# Altium schematic sheet FMC 400 Pin.SchDoc: Altium FMC Sheet
size A3; Date: 8/14/2017; ApprovedBy: NA; CompanyName: Cospan Design LLC; DrawnBy: Altium; Engineer: Altium; DocumentNumber: 16; SheetNumber: 16; SheetTotal: 20; Project: Enigma; SheetName: Altium FMC Sheet; ProjectPrettyName: Enigma; Client: Public
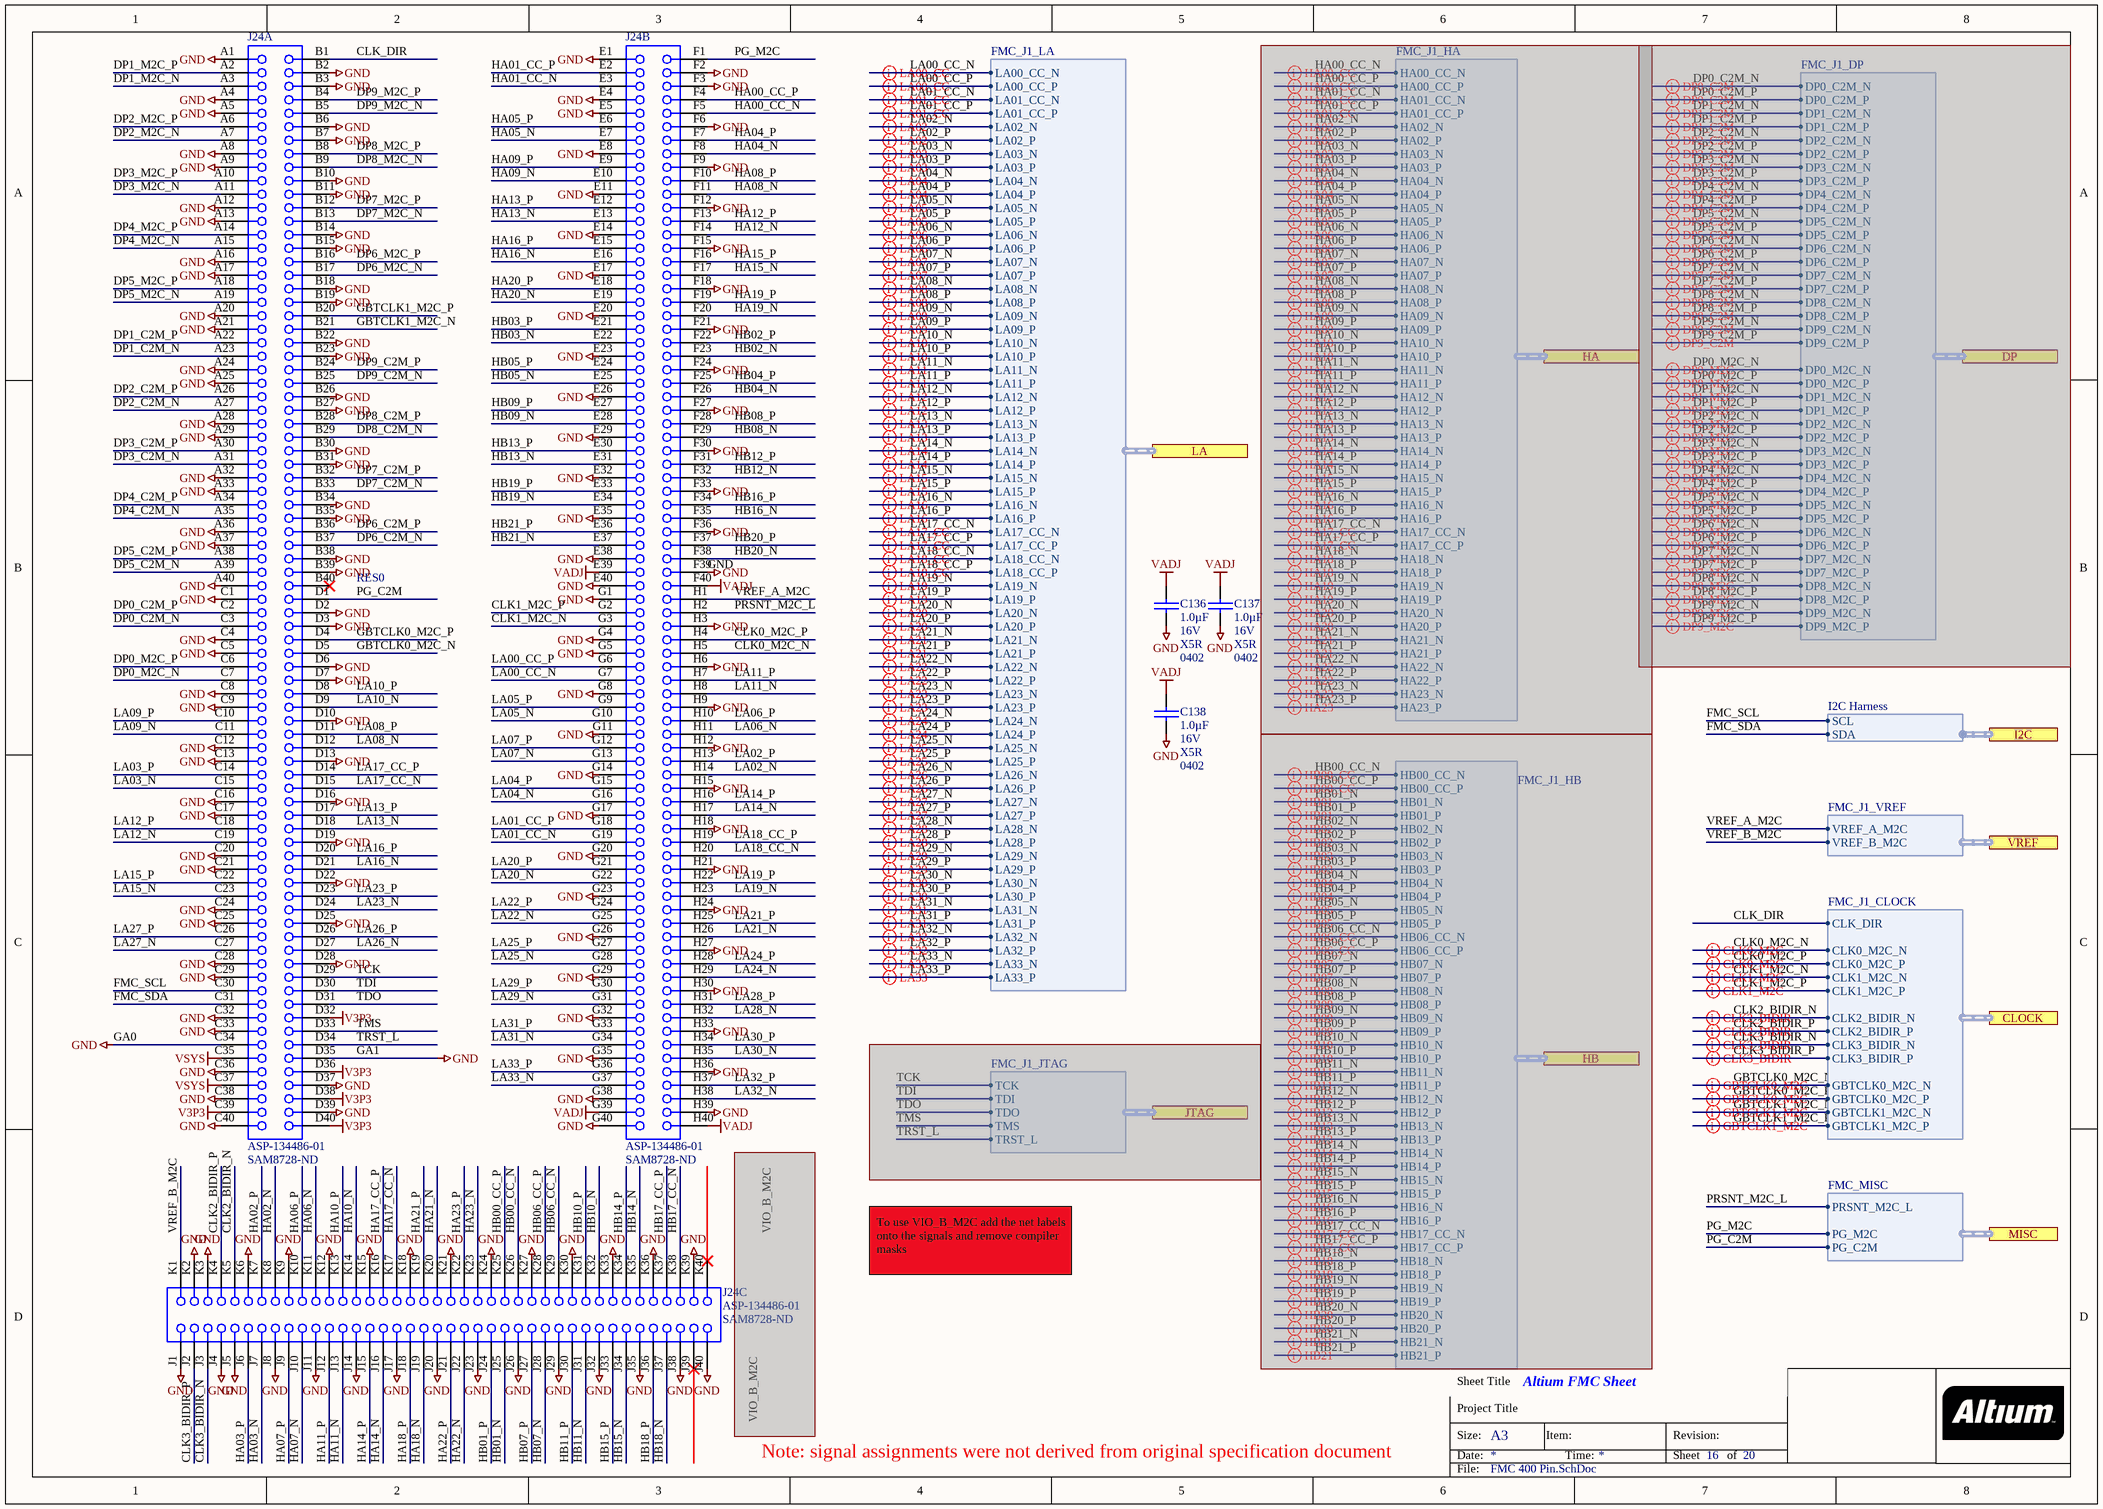
[diagram p0: FMC 400 Pin.SchDoc]

## Parts
C136  Capacitance: 1.0µF  Voltage - Rated: 16V  Temperature Coefficient: X5R  Package / Case: 0402  [C_ERA-0402]  (hidden comment: 1.0uF)
C137  Capacitance: 1.0µF  Voltage - Rated: 16V  Temperature Coefficient: X5R  Package / Case: 0402  [C_ERA-0402]  (hidden comment: 1.0uF)
C138  Capacitance: 1.0µF  Voltage - Rated: 16V  Temperature Coefficient: X5R  Package / Case: 0402  [C_ERA-0402]  (hidden comment: 1.0uF)
J24  ASP-134486-01  Supplier Part Number 1: SAM8728-ND  [BTB-SM1-27-2V400F]  (parts A,B,C of 3)

## Ports
CLOCK (harness FMC_J1_CLOCK), DP (harness FMC_J1_DP), HA (harness FMC_J1_HA), HB (harness FMC_J1_HB), I2C (harness I2C Harness), JTAG (harness FMC_J1_JTAG), LA (harness FMC_J1_LA), MISC (harness FMC_MISC), VREF (harness FMC_J1_VREF)

## Harnesses
FMC_J1_DP: DP1_C2M_N, DP1_C2M_P, DP1_M2C_N, DP1_M2C_P, DP2_C2M_N, DP2_C2M_P, DP2_M2C_N, DP2_M2C_P, DP3_C2M_N, DP3_C2M_P, DP3_M2C_N, DP3_M2C_P, DP4_C2M_N, DP4_C2M_P, DP4_M2C_N, DP4_M2C_P, DP5_C2M_N, DP5_C2M_P, DP5_M2C_N, DP5_M2C_P, DP6_C2M_N, DP6_C2M_P, DP6_M2C_N, DP6_M2C_P, DP7_C2M_N, DP7_C2M_P, DP7_M2C_N, DP7_M2C_P, DP8_C2M_N, DP8_C2M_P, DP8_M2C_N, DP8_M2C_P, DP9_C2M_N, DP9_C2M_P, DP9_M2C_N, DP9_M2C_P, DP0_C2M_N, DP0_C2M_P, DP0_M2C_N, DP0_M2C_P
FMC_J1_LA: LA05_N, LA05_P, LA06_N, LA06_P, LA09_N, LA09_P, LA10_N, LA10_P, LA13_N, LA13_P, LA14_N, LA14_P, LA23_N, LA23_P, LA26_N, LA26_P, LA27_N, LA27_P, LA02_N, LA02_P, LA03_N, LA03_P, LA04_N, LA04_P, LA07_N, LA07_P, LA08_N, LA08_P, LA11_N, LA11_P, LA12_N, LA12_P, LA15_N, LA15_P, LA16_N, LA16_P, LA19_N, LA19_P, LA20_N, LA20_P, LA21_N, LA21_P, LA22_N, LA22_P, LA24_N, LA24_P, LA25_N, LA25_P, LA28_N, LA28_P, LA29_N, LA29_P, LA30_N, LA30_P, LA31_N, LA31_P, LA32_N, LA32_P, LA33_N, LA33_P, LA00_CC_N, LA00_CC_P, LA01_CC_N, LA01_CC_P, LA17_CC_N, LA17_CC_P, LA18_CC_N, LA18_CC_P
FMC_J1_HA: HA04_N, HA04_P, HA05_N, HA05_P, HA08_N, HA08_P, HA09_N, HA09_P, HA12_N, HA12_P, HA13_N, HA13_P, HA15_N, HA15_P, HA16_N, HA16_P, HA19_N, HA19_P, HA20_N, HA20_P, HA02_N, HA02_P, HA03_N, HA03_P, HA06_N, HA06_P, HA07_N, HA07_P, HA10_N, HA10_P, HA11_N, HA11_P, HA14_N, HA14_P, HA18_N, HA18_P, HA21_N, HA21_P, HA22_N, HA22_P, HA23_N, HA23_P, HA17_CC_N, HA17_CC_P, HA00_CC_N, HA00_CC_P, HA01_CC_N, HA01_CC_P
FMC_J1_HB: HB02_N, HB02_P, HB03_N, HB03_P, HB04_N, HB04_P, HB05_N, HB05_P, HB08_N, HB08_P, HB09_N, HB09_P, HB12_N, HB12_P, HB13_N, HB13_P, HB16_N, HB16_P, HB19_N, HB19_P, HB20_N, HB20_P, HB21_N, HB21_P, HB01_N, HB01_P, HB07_N, HB07_P, HB10_N, HB10_P, HB11_N, HB11_P, HB14_N, HB14_P, HB15_N, HB15_P, HB18_N, HB18_P, HB17_CC_N, HB17_CC_P, HB06_CC_N, HB06_CC_P, HB00_CC_N, HB00_CC_P
FMC_MISC: PRSNT_M2C_L, PG_M2C, PG_C2M
FMC_J1_JTAG: TCK, TDI, TDO, TMS, TRST_L
FMC_J1_CLOCK: CLK2_BIDIR_N, CLK2_BIDIR_P, CLK3_BIDIR_N, CLK3_BIDIR_P, CLK0_M2C_N, CLK0_M2C_P, CLK1_M2C_N, CLK1_M2C_P, CLK_DIR, GBTCLK0_M2C_N, GBTCLK0_M2C_P, GBTCLK1_M2C_N, GBTCLK1_M2C_P
FMC_J1_VREF: VREF_A_M2C, VREF_B_M2C
I2C Harness: SCL, SDA

## Nets
GA0: C136.1 C137.1 C138.1 J24.A1 J24.A4 J24.A5 J24.A8 J24.A9 J24.A12 J24.A13 J24.A16 J24.A17 J24.A20 J24.A21 J24.A24 J24.A25 J24.A28 J24.A29 J24.A32 J24.A33 J24.A36 J24.A37 J24.A40 J24.B2 J24.B3 J24.B6 J24.B7 J24.B10 J24.B11 J24.B14 J24.B15 J24.B18 J24.B19 J24.B22 J24.B23 J24.B26 J24.B27 J24.B30 J24.B31 J24.B34 J24.B35 J24.B38 J24.B39 J24.C1 J24.C4 J24.C5 J24.C8 J24.C9 J24.C12 J24.C13 J24.C16 J24.C17 J24.C20 J24.C21 J24.C24 J24.C25 J24.C28 J24.C29 J24.C32 J24.C33 J24.C34 J24.C36 J24.C38 J24.C40 J24.D2 J24.D3 J24.D6 J24.D7 J24.D10 J24.D13 J24.D16 J24.D19 J24.D22 J24.D25 J24.D28 J24.D35 J24.D37 J24.D39 J24.E1 J24.E4 J24.E5 J24.E8 J24.E11 J24.E14 J24.E17 J24.E20 J24.E23 J24.E26 J24.E29 J24.E32 J24.E35 J24.E38 J24.E40 J24.F2 J24.F3 J24.F6 J24.F9 J24.F12 J24.F15 J24.F18 J24.F21 J24.F24 J24.F27 J24.F30 J24.F33 J24.F36 J24.F39 J24.G1 J24.G4 J24.G5 J24.G8 J24.G11 J24.G14 J24.G17 J24.G20 J24.G23 J24.G26 J24.G29 J24.G32 J24.G35 J24.G38 J24.G40 J24.H3 J24.H6 J24.H9 J24.H12 J24.H15 J24.H18 J24.H21 J24.H24 J24.H27 J24.H30 J24.H33 J24.H36 J24.H39 J24.J1 J24.J4 J24.J5 J24.J8 J24.J11 J24.J14 J24.J17 J24.J20 J24.J23 J24.J26 J24.J29 J24.J32 J24.J35 J24.J38 J24.J40 J24.K2 J24.K3 J24.K6 J24.K9 J24.K12 J24.K15 J24.K18 J24.K21 J24.K24 J24.K27 J24.K30 J24.K33 J24.K36 J24.K39  [also labelled GA1, GND]
V3P3: J24.C39 J24.D32 J24.D36 J24.D38 J24.D40
VADJ: C136.2 C137.2 C138.2 J24.E39 J24.F40 J24.G39 J24.H40
VSYS: J24.C35 J24.C37
CLK0_M2C_N: J24.H5 ; port CLOCK.CLK0_M2C_N
CLK0_M2C_P: J24.H4 ; port CLOCK.CLK0_M2C_P
CLK1_M2C_N: J24.G3 ; port CLOCK.CLK1_M2C_N
CLK1_M2C_P: J24.G2 ; port CLOCK.CLK1_M2C_P
CLK2_BIDIR_N: J24.K5 ; port CLOCK.CLK2_BIDIR_N
CLK2_BIDIR_P: J24.K4 ; port CLOCK.CLK2_BIDIR_P
CLK3_BIDIR_N: J24.J3 ; port CLOCK.CLK3_BIDIR_N
CLK3_BIDIR_P: J24.J2 ; port CLOCK.CLK3_BIDIR_P
CLK_DIR: J24.B1 ; port CLOCK.CLK_DIR
DP0_C2M_N: J24.C3
DP0_C2M_P: J24.C2
DP0_M2C_N: J24.C7
DP0_M2C_P: J24.C6
DP1_C2M_N: J24.A23
DP1_C2M_P: J24.A22
DP1_M2C_N: J24.A3
DP1_M2C_P: J24.A2
DP2_C2M_N: J24.A27
DP2_C2M_P: J24.A26
DP2_M2C_N: J24.A7
DP2_M2C_P: J24.A6
DP3_C2M_N: J24.A31
DP3_C2M_P: J24.A30
DP3_M2C_N: J24.A11
DP3_M2C_P: J24.A10
DP4_C2M_N: J24.A35
DP4_C2M_P: J24.A34
DP4_M2C_N: J24.A15
DP4_M2C_P: J24.A14
DP5_C2M_N: J24.A39
DP5_C2M_P: J24.A38
DP5_M2C_N: J24.A19
DP5_M2C_P: J24.A18
DP6_C2M_N: J24.B37
DP6_C2M_P: J24.B36
DP6_M2C_N: J24.B17
DP6_M2C_P: J24.B16
DP7_C2M_N: J24.B33
DP7_C2M_P: J24.B32
DP7_M2C_N: J24.B13
DP7_M2C_P: J24.B12
DP8_C2M_N: J24.B29
DP8_C2M_P: J24.B28
DP8_M2C_N: J24.B9
DP8_M2C_P: J24.B8
DP9_C2M_N: J24.B25
DP9_C2M_P: J24.B24
DP9_M2C_N: J24.B5
DP9_M2C_P: J24.B4
FMC_SCL: J24.C30 ; port I2C.SCL
FMC_SDA: J24.C31 ; port I2C.SDA
GBTCLK0_M2C_N: J24.D5 ; port CLOCK.GBTCLK0_M2C_N
GBTCLK0_M2C_P: J24.D4 ; port CLOCK.GBTCLK0_M2C_P
GBTCLK1_M2C_N: J24.B21 ; port CLOCK.GBTCLK1_M2C_N
GBTCLK1_M2C_P: J24.B20 ; port CLOCK.GBTCLK1_M2C_P
HA00_CC_N: J24.F5
HA00_CC_P: J24.F4
HA01_CC_N: J24.E3
HA01_CC_P: J24.E2
HA02_N: J24.K8
HA02_P: J24.K7
HA03_N: J24.J7
HA03_P: J24.J6
HA04_N: J24.F8
HA04_P: J24.F7
HA05_N: J24.E7
HA05_P: J24.E6
HA06_N: J24.K11
HA06_P: J24.K10
HA07_N: J24.J10
HA07_P: J24.J9
HA08_N: J24.F11
HA08_P: J24.F10
HA09_N: J24.E10
HA09_P: J24.E9
HA10_N: J24.K14
HA10_P: J24.K13
HA11_N: J24.J13
HA11_P: J24.J12
HA12_N: J24.F14
HA12_P: J24.F13
HA13_N: J24.E13
HA13_P: J24.E12
HA14_N: J24.J16
HA14_P: J24.J15
HA15_N: J24.F17
HA15_P: J24.F16
HA16_N: J24.E16
HA16_P: J24.E15
HA17_CC_N: J24.K17
HA17_CC_P: J24.K16
HA18_N: J24.J19
HA18_P: J24.J18
HA19_N: J24.F20
HA19_P: J24.F19
HA20_N: J24.E19
HA20_P: J24.E18
HA21_N: J24.K20
HA21_P: J24.K19
HA22_N: J24.J22
HA22_P: J24.J21
HA23_N: J24.K23
HA23_P: J24.K22
HB00_CC_N: J24.K26
HB00_CC_P: J24.K25
HB01_N: J24.J25
HB01_P: J24.J24
HB02_N: J24.F23
HB02_P: J24.F22
HB03_N: J24.E22
HB03_P: J24.E21
HB04_N: J24.F26
HB04_P: J24.F25
HB05_N: J24.E25
HB05_P: J24.E24
HB06_CC_N: J24.K29
HB06_CC_P: J24.K28
HB07_N: J24.J28
HB07_P: J24.J27
HB08_N: J24.F29
HB08_P: J24.F28
HB09_N: J24.E28
HB09_P: J24.E27
HB10_N: J24.K32
HB10_P: J24.K31
HB11_N: J24.J31
HB11_P: J24.J30
HB12_N: J24.F32
HB12_P: J24.F31
HB13_N: J24.E31
HB13_P: J24.E30
HB14_N: J24.K35
HB14_P: J24.K34
HB15_N: J24.J34
HB15_P: J24.J33
HB16_N: J24.F35
HB16_P: J24.F34
HB17_CC_N: J24.K38
HB17_CC_P: J24.K37
HB18_N: J24.J37
HB18_P: J24.J36
HB19_N: J24.E34
HB19_P: J24.E33
HB20_N: J24.F38
HB20_P: J24.F37
HB21_N: J24.E37
HB21_P: J24.E36
LA00_CC_N: J24.G7 ; port LA.LA00_CC_N
LA00_CC_P: J24.G6 ; port LA.LA00_CC_P
LA01_CC_N: J24.G19 ; port LA.LA01_CC_N
LA01_CC_P: J24.G18 ; port LA.LA01_CC_P
LA02_N: J24.H14 ; port LA.LA02_N
LA02_P: J24.H13 ; port LA.LA02_P
LA03_N: J24.C15 ; port LA.LA03_N
LA03_P: J24.C14 ; port LA.LA03_P
LA04_N: J24.G16 ; port LA.LA04_N
LA04_P: J24.G15 ; port LA.LA04_P
LA05_N: J24.G10 ; port LA.LA05_N
LA05_P: J24.G9 ; port LA.LA05_P
LA06_N: J24.H11 ; port LA.LA06_N
LA06_P: J24.H10 ; port LA.LA06_P
LA07_N: J24.G13 ; port LA.LA07_N
LA07_P: J24.G12 ; port LA.LA07_P
LA08_N: J24.D12 ; port LA.LA08_N
LA08_P: J24.D11 ; port LA.LA08_P
LA09_N: J24.C11 ; port LA.LA09_N
LA09_P: J24.C10 ; port LA.LA09_P
LA10_N: J24.D9 ; port LA.LA10_N
LA10_P: J24.D8 ; port LA.LA10_P
LA11_N: J24.H8 ; port LA.LA11_N
LA11_P: J24.H7 ; port LA.LA11_P
LA12_N: J24.C19 ; port LA.LA12_N
LA12_P: J24.C18 ; port LA.LA12_P
LA13_N: J24.D18 ; port LA.LA13_N
LA13_P: J24.D17 ; port LA.LA13_P
LA14_N: J24.H17 ; port LA.LA14_N
LA14_P: J24.H16 ; port LA.LA14_P
LA15_N: J24.C23 ; port LA.LA15_N
LA15_P: J24.C22 ; port LA.LA15_P
LA16_N: J24.D21 ; port LA.LA16_N
LA16_P: J24.D20 ; port LA.LA16_P
LA17_CC_N: J24.D15 ; port LA.LA17_CC_N
LA17_CC_P: J24.D14 ; port LA.LA17_CC_P
LA18_CC_N: J24.H20 ; port LA.LA18_CC_N
LA18_CC_P: J24.H19 ; port LA.LA18_CC_P
LA19_N: J24.H23 ; port LA.LA19_N
LA19_P: J24.H22 ; port LA.LA19_P
LA20_N: J24.G22 ; port LA.LA20_N
LA20_P: J24.G21 ; port LA.LA20_P
LA21_N: J24.H26 ; port LA.LA21_N
LA21_P: J24.H25 ; port LA.LA21_P
LA22_N: J24.G25 ; port LA.LA22_N
LA22_P: J24.G24 ; port LA.LA22_P
LA23_N: J24.D24 ; port LA.LA23_N
LA23_P: J24.D23 ; port LA.LA23_P
LA24_N: J24.H29 ; port LA.LA24_N
LA24_P: J24.H28 ; port LA.LA24_P
LA25_N: J24.G28 ; port LA.LA25_N
LA25_P: J24.G27 ; port LA.LA25_P
LA26_N: J24.D27 ; port LA.LA26_N
LA26_P: J24.D26 ; port LA.LA26_P
LA27_N: J24.C27 ; port LA.LA27_N
LA27_P: J24.C26 ; port LA.LA27_P
LA28_N: J24.H32 ; port LA.LA28_N
LA28_P: J24.H31 ; port LA.LA28_P
LA29_N: J24.G31 ; port LA.LA29_N
LA29_P: J24.G30 ; port LA.LA29_P
LA30_N: J24.H35 ; port LA.LA30_N
LA30_P: J24.H34 ; port LA.LA30_P
LA31_N: J24.G34 ; port LA.LA31_N
LA31_P: J24.G33 ; port LA.LA31_P
LA32_N: J24.H38 ; port LA.LA32_N
LA32_P: J24.H37 ; port LA.LA32_P
LA33_N: J24.G37 ; port LA.LA33_N
LA33_P: J24.G36 ; port LA.LA33_P
PG_C2M: J24.D1 ; port MISC.PG_C2M
PG_M2C: J24.F1 ; port MISC.PG_M2C
PRSNT_M2C_L: J24.H2 ; port MISC.PRSNT_M2C_L
TCK: J24.D29
TDI: J24.D30
TDO: J24.D31
TMS: J24.D33
TRST_L: J24.D34
VREF_A_M2C: J24.H1 ; port VREF.VREF_A_M2C
VREF_B_M2C: J24.K1 ; port VREF.VREF_B_M2C

Not connected (* = marked no-connect by the designer): J24 B40* J39* K40*

## Layout directives
differential pair: (no net found under the mark), CLK0_M2C_N, CLK0_M2C_P, CLK1_M2C_N, CLK1_M2C_P, CLK2_BIDIR_N, CLK2_BIDIR_P, CLK3_BIDIR_N, CLK3_BIDIR_P, GBTCLK0_M2C_N, GBTCLK0_M2C_P, GBTCLK1_M2C_N, GBTCLK1_M2C_P, LA00_CC_N, LA00_CC_P, LA01_CC_N, LA01_CC_P, LA02_N, LA02_P, LA03_N, LA03_P, LA04_N, LA04_P, LA05_N, LA05_P, LA06_N, LA06_P, LA07_N, LA07_P, LA08_N, LA08_P, LA09_N, LA09_P, LA10_N, LA10_P, LA11_N, LA11_P, LA12_N, LA12_P, LA13_N, LA13_P, LA14_N, LA14_P, LA15_N, LA15_P, LA16_N, LA16_P, LA17_CC_N, LA17_CC_P, LA18_CC_N, LA18_CC_P, LA19_N, LA19_P, LA20_N, LA20_P, LA21_N, LA21_P, LA22_N, LA22_P, LA23_N, LA23_P, LA24_N, LA24_P, LA25_N, LA25_P, LA26_N, LA26_P, LA27_N, LA27_P, LA28_N, LA28_P, LA29_N, LA29_P, LA30_N, LA30_P, LA31_N, LA31_P, LA32_N, LA32_P, LA33_N, LA33_P

## Notes on the sheet
- RES0
- To use VIO_B_M2C add the net labels onto the signals and remove compiler masks
- Note: signal assignments were not derived from original specification document
- Sheet Title
- Project Title
- Size:
- Date:
- A3
- Item:
- Time:
- Revision:
- Sheet
- of
- File:

## Library data of the parts
C136-C138 = C_0402_1.0UF_16V: CAP CER 1.0UF 16V X5R 0402; Manufacturer: Taiyo Yuden; Manufacturer Part Number: EMK105BJ105KV-F; Tolerance: ±10%; Supplier 1: Digi-Key; RoHS: RoHS Compliant; Category: Capacitors; Stock 1: 489909; Pricing 1: 1=0.1, 10=0.063, 100=0.028, 500=0.01998, 1000=0.0157, 2500=0.01427, 5000=0.01313 (USD); Packaging: Cut Tape (CT); Part Status: Active; Operating Temperature: -55°C ~ 85°C; Features: -; Ratings: -; Applications: General Purpose; Mounting Type: Surface Mount, MLCC; Size / Dimension: 0.039" L x 0.020" W (1.00mm x 0.50mm); Height - Seated (Max): -; Thickness (Max): 0.022" (0.55mm); Lead Spacing: -; Lead Style: -; ComponentLink1URL: http://ds.yuden.co.jp/TYCOMPAS/ut/detail.do?productNo=EMK105BJ105KV-F&fileName=EMK105BJ105KV-F_SS&mode=specSheetDownload; ComponentLink1Description: http://ds.yuden.co.jp/TYCOMPAS/ut/detail.do?productNo=EMK105BJ105KV-F&fileName=EMK105BJ105KV-F_SS&mode=specSheetDownload; Supplier Part Number 1: 587-2477-1-ND
J24 = J_ASP-134486-01: CONN SNGL-END ARRAY FMALE 400POS; Manufacturer: Samtec Inc.; Connector Type: Array, Female Sockets; Number of Positions: 400; Pitch: 0.050" (1.27mm); Supplier 1: Digi-Key; Manufacturer Part Number: ASP-134486-01; RoHS: RoHS Compliant; Category: Connectors, Interconnects; Stock 1: 64; Pricing 1: 1=20.4, 10=19.67, 25=18.9412, 50=18.5768, 100=18.2125, 250=17.84824, 500=17.484 (USD); Packaging: Tape & Reel (TR); Part Status: Active; Number of Rows: 10; Mounting Type: Surface Mount; Features: Board Guide; Contact Finish: Gold; Contact Finish Thickness: 30µin (0.76µm); Mated Stacking Heights: -; Height Above Board: 0.258" (6.55mm)